# Altium schematic sheet USB_Mass_Storage.SchDoc
size B; DocumentNumber: 1; SheetNumber: 1; SheetTotal: 1
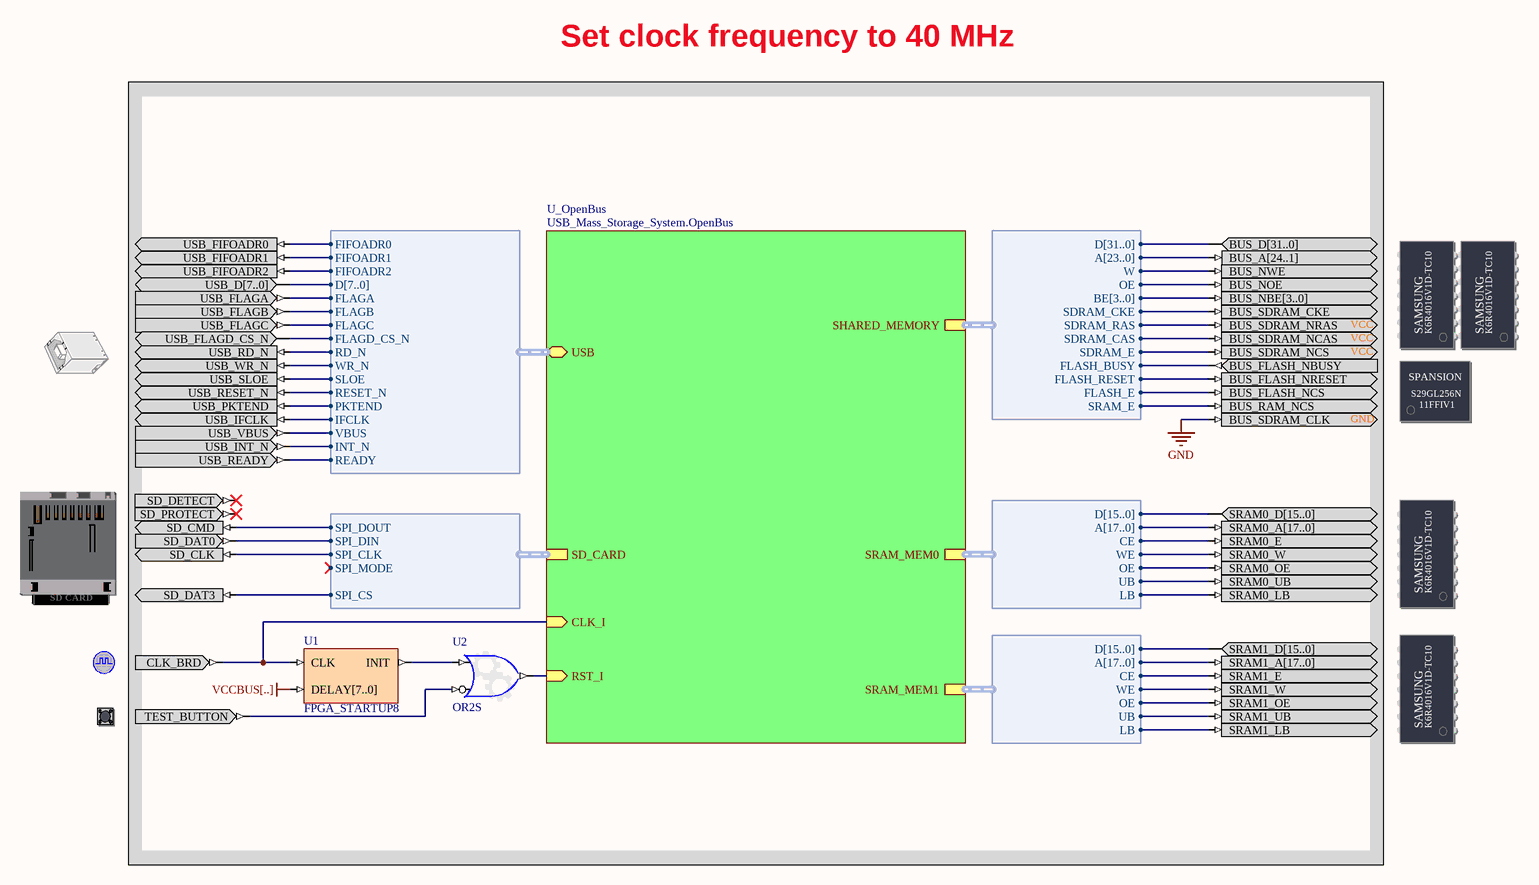
[diagram p0: USB_Mass_Storage.SchDoc]

## Parts
(Parts that share a designator on the sheet are numbered #1, #2 ... from top to bottom, then left to right.)
?#1  USB  (value not drawn)
?#2  SHARED_SRAM_FLASH_DAUGHTER  (value not drawn)
?#3  SD_CARD  (value not drawn)
?#4  SRAM_DAUGHTER0  (value not drawn)
?#5  SRAM_DAUGHTER1  (value not drawn)
?#6  CLOCK_BOARD  (value not drawn)
?#7  TEST_BUTTON  (value not drawn)
U1  FPGA_STARTUP8
U2  OR2S

## Sub-sheets
U_OpenBus = USB_Mass_Storage_System.OpenBus: SD_CARD (harness SPI_W_NB), SRAM_MEM0 (harness WB_MEM_CTRL_SRAM16_A18), SRAM_MEM1 (harness WB_MEM_CTRL_SRAM16_A18), SHARED_MEMORY (harness WB_SHARED_MEM_CTRL), RST_I (in), CLK_I (in), USB (harness WB_USB8)

## Harnesses
WB_SHARED_MEM_CTRL: D[31..0], A[23..0], W, OE, BE[3..0], SDRAM_CKE, SDRAM_RAS, SDRAM_CAS, SDRAM_E, FLASH_BUSY, FLASH_RESET, FLASH_E, SRAM_E
WB_MEM_CTRL_SRAM16_A18: D[15..0], A[17..0], CE, WE, OE, UB, LB
SPI_W_NB: SPI_DOUT, SPI_DIN, SPI_CLK, SPI_MODE, SPI_CS
WB_USB8: FIFOADR0, FIFOADR1, FIFOADR2, D[7..0], FLAGA, FLAGB, FLAGC, FLAGD_CS_N, RD_N, WR_N, SLOE, RESET_N, PKTEND, IFCLK, VBUS, INT_N, READY

## Nets
GND: ?#2.BUS_SDRAM_CLK
VCCBUS[..]: U1.DELAY[7..0]
Net?#1_USB_D[7..0]: ?#1.USB_D[7..0] ; sheet U_OpenBus/USB.D[7..0]
Net?#1_USB_FIFOADR0: ?#1.USB_FIFOADR0 ; sheet U_OpenBus/USB.FIFOADR0
Net?#1_USB_FIFOADR1: ?#1.USB_FIFOADR1 ; sheet U_OpenBus/USB.FIFOADR1
Net?#1_USB_FIFOADR2: ?#1.USB_FIFOADR2 ; sheet U_OpenBus/USB.FIFOADR2
Net?#1_USB_FLAGA: ?#1.USB_FLAGA ; sheet U_OpenBus/USB.FLAGA
Net?#1_USB_FLAGB: ?#1.USB_FLAGB ; sheet U_OpenBus/USB.FLAGB
Net?#1_USB_FLAGC: ?#1.USB_FLAGC ; sheet U_OpenBus/USB.FLAGC
Net?#1_USB_FLAGD_CS_N: ?#1.USB_FLAGD_CS_N ; sheet U_OpenBus/USB.FLAGD_CS_N
Net?#1_USB_IFCLK: ?#1.USB_IFCLK ; sheet U_OpenBus/USB.IFCLK
Net?#1_USB_INT_N: ?#1.USB_INT_N ; sheet U_OpenBus/USB.INT_N
Net?#1_USB_PKTEND: ?#1.USB_PKTEND ; sheet U_OpenBus/USB.PKTEND
Net?#1_USB_RD_N: ?#1.USB_RD_N ; sheet U_OpenBus/USB.RD_N
Net?#1_USB_READY: ?#1.USB_READY ; sheet U_OpenBus/USB.READY
Net?#1_USB_RESET_N: ?#1.USB_RESET_N ; sheet U_OpenBus/USB.RESET_N
Net?#1_USB_SLOE: ?#1.USB_SLOE ; sheet U_OpenBus/USB.SLOE
Net?#1_USB_VBUS: ?#1.USB_VBUS ; sheet U_OpenBus/USB.VBUS
Net?#1_USB_WR_N: ?#1.USB_WR_N ; sheet U_OpenBus/USB.WR_N
Net?#2_BUS_A[24..1]: ?#2.BUS_A[24..1] ; sheet U_OpenBus/SHARED_MEMORY.A[23..0]
Net?#2_BUS_D[31..0]: ?#2.BUS_D[31..0] ; sheet U_OpenBus/SHARED_MEMORY.D[31..0]
Net?#2_BUS_FLASH_NBUSY: ?#2.BUS_FLASH_NBUSY ; sheet U_OpenBus/SHARED_MEMORY.FLASH_BUSY
Net?#2_BUS_FLASH_NCS: ?#2.BUS_FLASH_NCS ; sheet U_OpenBus/SHARED_MEMORY.FLASH_E
Net?#2_BUS_FLASH_NRESET: ?#2.BUS_FLASH_NRESET ; sheet U_OpenBus/SHARED_MEMORY.FLASH_RESET
Net?#2_BUS_NBE[3..0]: ?#2.BUS_NBE[3..0] ; sheet U_OpenBus/SHARED_MEMORY.BE[3..0]
Net?#2_BUS_NOE: ?#2.BUS_NOE ; sheet U_OpenBus/SHARED_MEMORY.OE
Net?#2_BUS_NWE: ?#2.BUS_NWE ; sheet U_OpenBus/SHARED_MEMORY.W
Net?#2_BUS_RAM_NCS: ?#2.BUS_RAM_NCS ; sheet U_OpenBus/SHARED_MEMORY.SRAM_E
Net?#2_BUS_SDRAM_CKE: ?#2.BUS_SDRAM_CKE ; sheet U_OpenBus/SHARED_MEMORY.SDRAM_CKE
Net?#2_BUS_SDRAM_NCAS: ?#2.BUS_SDRAM_NCAS ; sheet U_OpenBus/SHARED_MEMORY.SDRAM_CAS
Net?#2_BUS_SDRAM_NCS: ?#2.BUS_SDRAM_NCS ; sheet U_OpenBus/SHARED_MEMORY.SDRAM_E
Net?#2_BUS_SDRAM_NRAS: ?#2.BUS_SDRAM_NRAS ; sheet U_OpenBus/SHARED_MEMORY.SDRAM_RAS
Net?#3_SD_CLK: ?#3.SD_CLK ; sheet U_OpenBus/SD_CARD.SPI_CLK
Net?#3_SD_CMD: ?#3.SD_CMD ; sheet U_OpenBus/SD_CARD.SPI_DOUT
Net?#3_SD_DAT0: ?#3.SD_DAT0 ; sheet U_OpenBus/SD_CARD.SPI_DIN
Net?#3_SD_DAT3: ?#3.SD_DAT3 ; sheet U_OpenBus/SD_CARD.SPI_CS
Net?#4_SRAM0_A[17..0]: ?#4.SRAM0_A[17..0] ; sheet U_OpenBus/SRAM_MEM0.A[17..0]
Net?#4_SRAM0_D[15..0]: ?#4.SRAM0_D[15..0] ; sheet U_OpenBus/SRAM_MEM0.D[15..0]
Net?#4_SRAM0_E: ?#4.SRAM0_E ; sheet U_OpenBus/SRAM_MEM0.CE
Net?#4_SRAM0_LB: ?#4.SRAM0_LB ; sheet U_OpenBus/SRAM_MEM0.LB
Net?#4_SRAM0_OE: ?#4.SRAM0_OE ; sheet U_OpenBus/SRAM_MEM0.OE
Net?#4_SRAM0_UB: ?#4.SRAM0_UB ; sheet U_OpenBus/SRAM_MEM0.UB
Net?#4_SRAM0_W: ?#4.SRAM0_W ; sheet U_OpenBus/SRAM_MEM0.WE
Net?#5_SRAM1_A[17..0]: ?#5.SRAM1_A[17..0] ; sheet U_OpenBus/SRAM_MEM1.A[17..0]
Net?#5_SRAM1_D[15..0]: ?#5.SRAM1_D[15..0] ; sheet U_OpenBus/SRAM_MEM1.D[15..0]
Net?#5_SRAM1_E: ?#5.SRAM1_E ; sheet U_OpenBus/SRAM_MEM1.CE
Net?#5_SRAM1_LB: ?#5.SRAM1_LB ; sheet U_OpenBus/SRAM_MEM1.LB
Net?#5_SRAM1_OE: ?#5.SRAM1_OE ; sheet U_OpenBus/SRAM_MEM1.OE
Net?#5_SRAM1_UB: ?#5.SRAM1_UB ; sheet U_OpenBus/SRAM_MEM1.UB
Net?#5_SRAM1_W: ?#5.SRAM1_W ; sheet U_OpenBus/SRAM_MEM1.WE
Net?#6_CLK_BRD: ?#6.CLK_BRD U1.CLK ; sheet U_OpenBus/CLK_I
Net?#7_TEST_BUTTON: ?#7.TEST_BUTTON U2.I1
NetU1_INIT: U1.INIT U2.I0
NetU2_O: U2.O ; sheet U_OpenBus/RST_I

Not connected (* = marked no-connect by the designer): ?#3 SD_DETECT* SD_PROTECT*

## Notes on the sheet
- Set clock frequency to 40 MHz
- Title
- Size:
- Date:
- B
- Number:
- Time:
- Revision:
- Sheet
- of
- File:
- (in symbol SD_CARD) SD CARD
- (in symbol SHARED_SRAM_FLASH_DAUGHTER) VCC; SAMSUNG; K6R4016V1D-TC10; SPANSION; S29GL256N; 11FFIV1; GND
- (in symbol SRAM_DAUGHTER0) SAMSUNG; K6R4016V1D-TC10
- (in symbol SRAM_DAUGHTER1) SAMSUNG; K6R4016V1D-TC10

## Library data of the parts
?#1 = USB: High Speed USB 2.0; PortComponent: True; Published: 22-Jan-2007; Publisher: Altium Limited
?#2 = SHARED_SRAM_FLASH_DAUGHTER: Common-Bus SRAM Flash- Daughterboard; PortComponent: True; IncludeInDSF: USE_PARALLEL_FLASH; Published: 14-May-2007; Publisher: Altium Limited; HelpURL: TR0143 NanoBoard Technical Reference Manual - NB2.pdf#page=23
?#3 = SD_CARD: Secure Digital Card Socket; PortComponent: True; Published: 22-Jan-2007; Publisher: Altium Limited; UseInDSF: True; HelpURL: TR0146 Technical Reference for Altium's Mass Storage Peripheral Board PB02.pdf#page=7
?#4 = SRAM_DAUGHTER0: Free Static RAM - Daughterboard; PortComponent: True; Published: 14-May-2007; Publisher: Altium Limited; HelpURL: TR0143 NanoBoard Technical Reference Manual - NB2.pdf#page=24
?#5 = SRAM_DAUGHTER1: Free Static RAM - Daughterboard; PortComponent: True; Published: 14-May-2007; Publisher: Altium Limited; HelpURL: TR0143 NanoBoard Technical Reference Manual - NB2.pdf#page=24
?#6 = CLOCK_BOARD: Global System Clock Supply; PortComponent: True; Published: 19-Nov-2003; Publisher: Altium Limited; HelpURL: TR0143 Technical Reference Manual for Altium's Desktop NanoBoard NB2DSK01.pdf#page=41; UseInDSF: True
?#7 = TEST_BUTTON: Test / Reset Button; PortComponent: True; Published: 19-Nov-2003; Publisher: Altium Limited; HelpURL: TR0143 Technical Reference Manual for Altium's Desktop NanoBoard NB2DSK01.pdf#page=53
U1 = FPGA_STARTUP8: FPGA Startup With 8 Bit Delay; Published: 9-Dec-2004; Publisher: Altium Limited; HelpURL: CR0119 FPGA_STARTUPx Powerup Delay Unit.pdf; LastRevisionNo: 1.00.00; ComponentLink1Description: Core &Resource Usage; ComponentLink1URL: CR0139 FPGA Peripheral Resource Usage.pdf#page=11
U2 = GATE: Configurable Generic Gate; ConfiguratorName: GENERIC_GATE; ConfigurationParameters: {}Version[1.0]{}GateKind[OR]{}BusInput[False]{}GateInputType[Bit]{}GateOutputOption[Normal]{}BusWidth[8]{}RegisterOutputs[False]{}NegativeClockEdge[False]{}InputCount[2]{}InputInvert0[False]{}InputInvert1[True]{}; LastRevisionNo: 1.00.00; Published: 3-Sep-2008; Publisher: Altium Limited